# Altium schematic sheet RS485.SchDoc
size A4; SheetNumber: 4; SheetTotal: 6
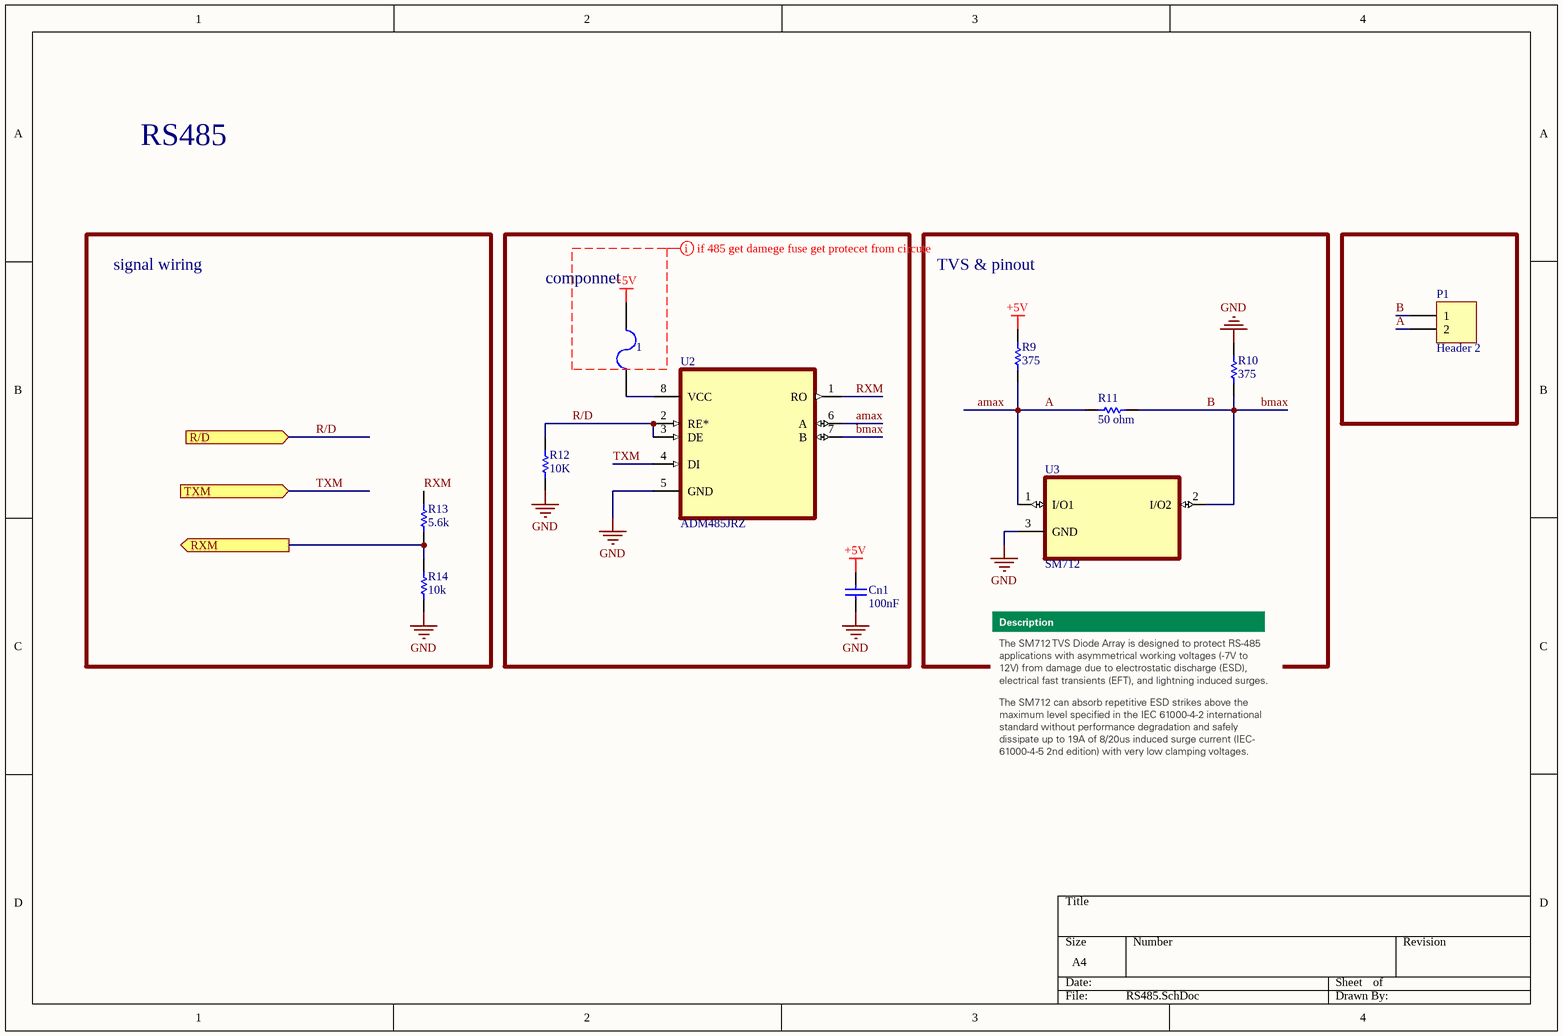
[diagram p0: RS485.SchDoc]

## Parts
1  F=1.0 A  [SMD_RES_0805]  (value not drawn)
Cn1  100nF  [RES 0603 (1608X06L)]
P1  Header 2  [HDR1X2]
R9  375  [RES 0603 (1608X06L)]
R10  375  [RES 0603 (1608X06L)]
R11  50 ohm  [RES 0603 (1608X06L)]
R12  10K  [RES 0603 (1608X06L)]
R13  5.6k  [RES 0603 (1608X06L)]
R14  10k  [RES 0603 (1608X06L)]
U2  ADM485JRZ  [SOIC127P600X175-8N]
U3  SM712  [SOT95P237X112-3N]

## Blocks framed on the sheet
signal wiring: R13 R14
componnet: 1 Cn1 R12 U2
TVS & pinout: R9-R11 U3

## Ports
R/D (in), RXM (out), TXM (in)

## Nets
+5V: 1.2 Cn1.2 R9.1
GND: Cn1.1 R10.1 R12.2 R14.2 U2.5(GND) U3.3(GND)
A: P1.2 R9.2 R11.1 U2.6(A) U3.1(I/O1)  [also labelled amax]
B: P1.1 R10.2 R11.2 U2.7(B) U3.2(I/O2)  [also labelled bmax]
R/D: R12.1 U2.2(RE*) U2.3(DE) ; port R/D
RXM: R13.1 U2.1(RO)
RXM: R13.2 R14.1 ; port RXM  [a separate net that carries the same name]
TXM: U2.4(DI) ; port TXM
Net1_1: 1.1 U2.8(VCC)

## Layout directives
mark named if 485 get damege fuse get protecet from circute: +5V

## Notes on the sheet
- RS485

## Library data of the parts
1 = Fuse SMD1206: SMD Fuses 1206; Designer: Abbas Basereh; Desc.: SMD Fuses 1206; Data: 16-12-2016
Cn1 = CAP SMD PACKAGE: TOTAL CAPACITOR SMD PACK; Designer: Abbas Basereh; Desc.: CAP SMD TOTAL PACKAGES; Data: 2017-3-10; VALUE: 100nF
P1 = Header 2: Header, 2-Pin; LatestRevisionDate: 17-Jul-2002; LatestRevisionNote: Re-released for DXP Platform.; Publisher: Altium Limited
R9-R14 = RES 0805 0.125W: RES 0805; Designer: Abbas Basereh; Desc.: RES SMD 0805; Data: 16-12-2016
U2 = ADM485JRZ: EIA RS-485 Transceiver; MF: {'manufacturer': u'Analog Devices'}; Price: None; Package: None; Availability: Unavailable; Value: *; MP: ADM485JRZ
U3 = SM712: TVS Diode; MF: {'manufacturer': u'Semtech'}; Availability: Unavailable; Value: *; Price: None; MP: SM712; Package: None